# Altium project TASK1.1.PrjPcb
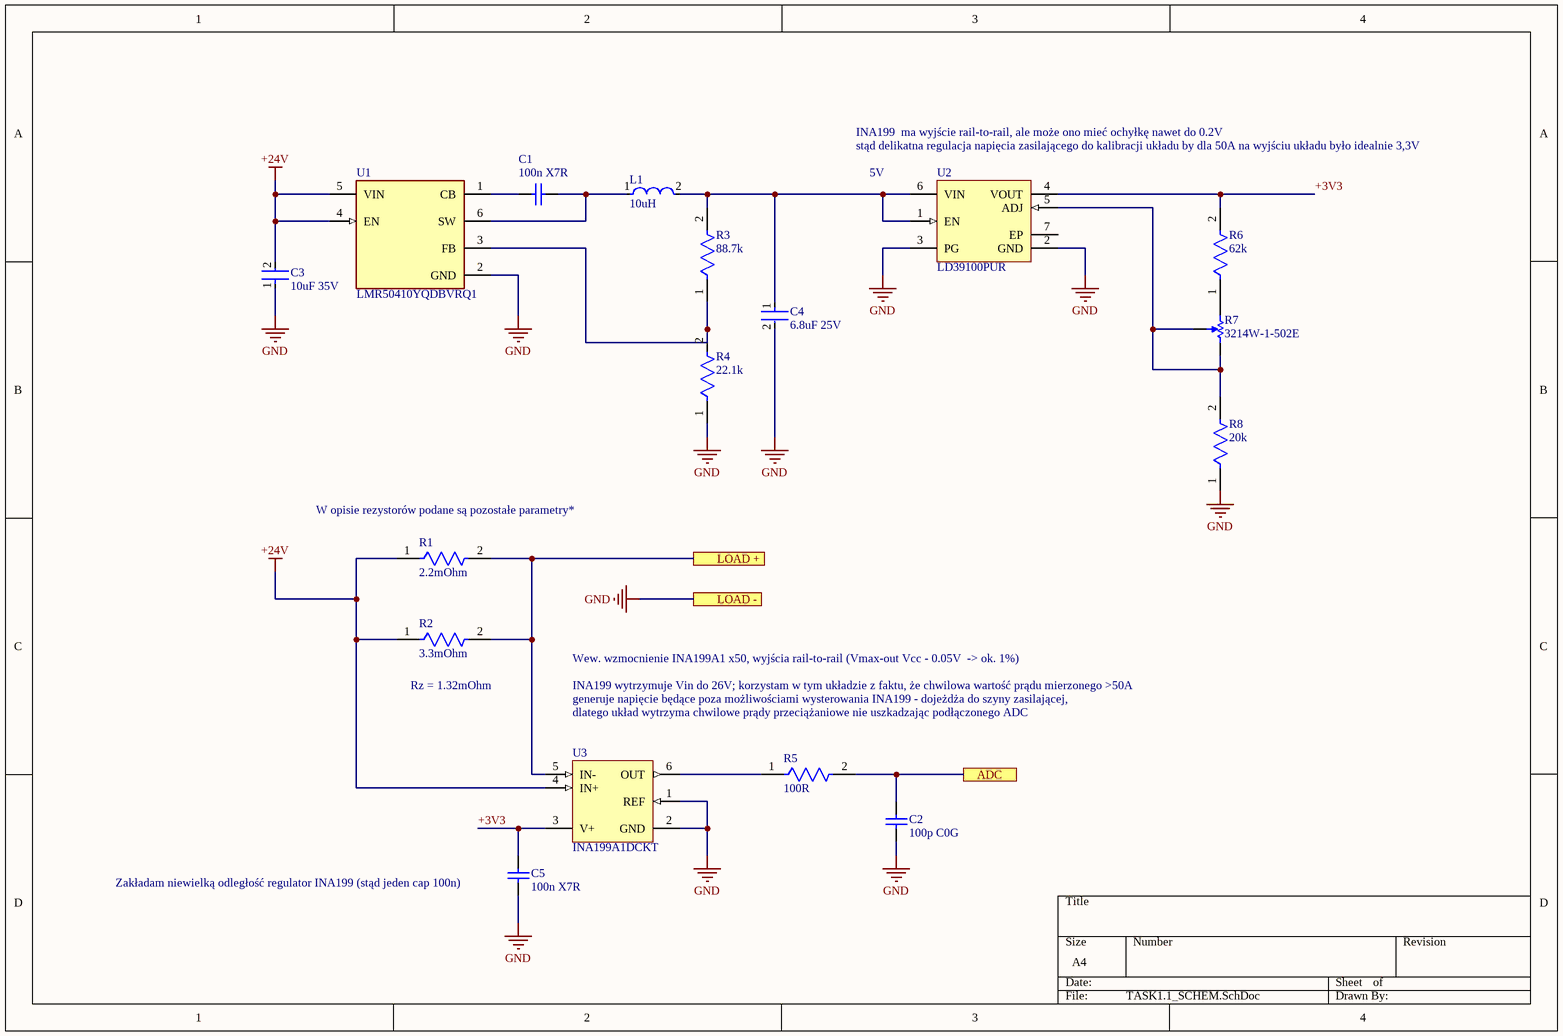
[diagram p0: TASK1.1_SCHEM.SchDoc]
1 sheet, 17 parts. Net scope: flat (ports and power ports of the same name join across sheets).
Board file: TASK1.1_PCB.PcbDoc

## Sheet TASK1.1_SCHEM.SchDoc
size A4; SheetNumber: 1; SheetTotal: 1

### Parts
C1  100n X7R  [CAPC1608X90X35LL15T15]
C2  100p C0G  [CAPC1608X95X40ML15T15]
C3  10uF 35V  [FP-C3216-160-0_2-IPC_C]
C4  6.8uF 25V  [FP-C2012-125-0_2-IPC_A]
C5  100n X7R  [CAPC1608X90X35LL15T15]
L1  10uH  [FP-NR6045-MFG]
R1  2.2mOhm  [FP-CRCW2512-e3-IPC_C]
R2  3.3mOhm  [FP-CRCW2512-e3-IPC_C]
R3  88.7k  [FP-CRCW0603-e3-MFG]
R4  22.1k  [FP-RP73P-1J-MFG]
R5  100R  [FP-ERA3A-IPC_B]
R6  62k  [FP-ERJ2RK-MFG]
R7  3214W-1-502E  [BOUR-3214W_V]
R8  20k  [FP-RC0402-0_4-MFG]
U1  LMR50410YQDBVRQ1  [FP-DBV0006A-MFG]
U2  LD39100PUR  [DFN6D_M]
U3  INA199A1DCKT  [DCK0006A_N]

### Ports
ADC, LOAD +, LOAD -

### Nets
+24V: C3.2 R1.1 R2.1 U1.4(EN) U1.5(VIN) U3.4(IN+)
GND: C2.1 C3.1 C4.2 C5.1 R4.1 R8.1 U1.2(GND) U2.2(GND) U2.3(PG) U3.1(REF) U3.2(GND) ; port LOAD -
+3V3: C5.2 R6.2 U2.4(VOUT) U3.3(V+)
NetC1_1: C1.1 U1.1(CB)
NetC1_2: C1.2 L1.1 U1.6(SW)
NetC2_2: C2.2 R5.2 ; port ADC
NetC4_1: C4.1 L1.2 R3.2 U2.1(EN) U2.6(VIN)
NetR1_2: R1.2 R2.2 U3.5(IN-) ; port LOAD +
NetR3_1: R3.1 R4.2 U1.3(FB)
NetR5_1: R5.1 U3.6(OUT)
NetR6_1: R6.1 R7.1
NetR7_2: R7.2 R7.3 R8.2 U2.5(ADJ)

Not connected (* = marked no-connect by the designer): U2 7(EP)

### Notes on the sheet
- INA199  ma wyjście rail-to-rail, ale może ono mieć ochyłkę nawet do 0.2V
- (near U2) stąd delikatna regulacja napięcia zasilającego do kalibracji układu by dla 50A na wyjściu układu było idealnie 3,3V
- 5V
- (near R1) W opisie rezystorów podane są pozostałe parametry*
- (near R2) Rz = 1.32mOhm
- Wew. wzmocnienie INA199A1 x50, wyjścia rail-to-rail (Vmax-out Vcc - 0.05V  -> ok. 1%)
- INA199 wytrzymuje Vin do 26V; korzystam w tym układzie z faktu, że chwilowa wartość prądu mierzonego >50A
- generuje napięcie będące poza możliwościami wysterowania INA199 - dojeżdża do szyny zasilającej,
- dlatego układ wytrzyma chwilowe prądy przeciążaniowe nie uszkadzając podłączonego ADC
- (near C5) Zakładam niewielką odległość regulator INA199 (stąd jeden cap 100n)

### Library data of the parts
C1 C5 = CMP-2006-02168-1: Manufacturer: AVX Interconnect / Elco; Part Number: LD035C104KAB2A
C2 = CMP-2006-01530-1: Manufacturer: Vitramon; Part Number: VJ0603A101JXACW1BC
C3 = CMP-2000-06048-2: Multilayer Ceramic Capacitors 10uF ±20% 35V X7R SMD 1206; RoHS Compliant: Yes; Voltage Rating (DC): 35V; Termination: SMD/SMT; Thickness: 0.071inch; Max Operating Temperature: 125°C; Length: 3.2mm; Width: 0.063inch; Tolerance: 20%; Case Code (Metric): 3216; Capacitance: 10uF; REACH SVHC: No SVHC; Case/Package: 1206; Dielectric: X7R; Series: C; Min Operating Temperature: -55°C; Resistor Type: Ceramic; Weight: 0.000571oz; Voltage Rating: 35V; Mount: Surface Mount; Package Quantity: 2000; Case Code (Imperial): 1206; Depth: 1.6mm; Packaging: Tape and Reel; Dielectric Material: Ceramic; Lead Free: Lead Free; Height: 1.6mm; Construction: Flat
C4 = CMP-08246-007145-1: Multilayer Ceramic Capacitors 6.8μF ±20% 25V X5R SMD 0805; Case Code (Metric): 2012; Case Code (Imperial): 0805; Dielectric: X5R; Package Quantity: 1; Min Operating Temperature: -55°C; Construction: Flat; Tolerance: 20%; Voltage Rating: 25V; Weight: 0.000194oz; Height: 1.25mm; Case/Package: 0805; Dielectric Material: Ceramic; Length: 2mm; Lead Free: Lead Free; Mount: Surface Mount; RoHS Compliant: Yes; Voltage Rating (DC): 25V; Series: C; Depth: 1.25mm; Termination: SMD/SMT; Capacitance: 6.8uF; Thickness: 0.057inch; Width: 0.049inch; Max Operating Temperature: 85°C; Packaging: Tape and Reel; Resistor Type: Ceramic
L1 = CMP-14484-001321-1: Shielded Wirewound Inductor 10uH 20% 2.8A 59.8mΩ SMD; DC Resistance (DCR): 59.8mR; Test Frequency: 100kHz; Self Resonant Frequency: 12MHz; Core Material: Ferrite; Max DC Current: 3.1A; RMS Current (Irms): 2.4A; Inductance: 10uH; Length: 6mm; Height - Seated (Max): 0.177inch; Series: NRS; Min Operating Temperature: -25°C; Tolerance: 20%; Radiation Hardening: No; Halogen Free: Halogen Free; Shielding: Shielded; Resistor Type: Wirewound; Case/Package: Nonstandard; Number of Pins: 2; Package Quantity: 1500; Width: 0.236inch; Depth: 6.2mm; Max Operating Temperature: 125°C; Packaging: Tape and Reel; Lead Free: Lead Free; Mount: Surface Mount; RoHS Compliant: Yes; Height: 4.5mm; Lead Pitch: 4.7mm; Saturation Current: 3.1A; Termination: SMD/SMT; Current Rating: 2.4A; Inductance Tolerance: 20%
R1 = CMP-02407-005447-1: WSL25122L200FEA18 / RES 0.0022 OHM 1% 2W 2512; Power Rating: 1W; Temperature Coefficient: 100ppm/°C; Voltage Rating: 500V; Resistance: 1MR; Height: 0.6mm; Number of Pins: 2; Min Operating Temperature: -55°C; Weight: 0.001429oz; Contact Plating: Tin; Max Power Dissipation: 1W; Radiation Hardening: No; REACH SVHC: No SVHC; Tolerance: 1%; Termination: SMD/SMT; Lead Free: Lead Free; Package Quantity: 10; Voltage Rating (DC): 500V; Case Code (Imperial): 2512; Packaging: Tape and Reel; Military Standard: Not; Width: 3.15mm; Case/Package: 2512; Case Code (Metric): 6432; Length: 6.3mm; Max Operating Temperature: 155°C; Number of Terminations: 2; Depth: 3.15mm; Composition: Thick Film; Features: Automotive AEC-Q200
R2 = CMP-02407-005447-1: WSL28163L300FEH / RES 0.0033 OHM 1% 2W 2816; Power Rating: 1W; Temperature Coefficient: 100ppm/°C; Voltage Rating: 500V; Resistance: 1MR; Height: 0.6mm; Number of Pins: 2; Min Operating Temperature: -55°C; Weight: 0.001429oz; Contact Plating: Tin; Max Power Dissipation: 1W; Radiation Hardening: No; REACH SVHC: No SVHC; Tolerance: 1%; Termination: SMD/SMT; Lead Free: Lead Free; Package Quantity: 10; Voltage Rating (DC): 500V; Case Code (Imperial): 2512; Packaging: Tape and Reel; Military Standard: Not; Width: 3.15mm; Case/Package: 2512; Case Code (Metric): 6432; Length: 6.3mm; Max Operating Temperature: 155°C; Number of Terminations: 2; Depth: 3.15mm; Composition: Thick Film; Features: Automotive AEC-Q200
R3 = CMP-1012-00730-3: RES Thick Film, 88.7kΩ, 1%, 0.1W, 100ppm/°C, 0603; Resistance: 88.7kR; Power Rating: 100mW; Voltage Rating: 75V; Height: 0.45mm; Weight: 7.1E-05oz; Max Operating Temperature: 155°C; Tolerance: 1%; Radiation Hardening: No; Military Standard: Not; Composition: Thick Film; Contact Plating: Tin; Packaging: Tape and Reel; Case/Package: 0603; Package Quantity: 10; Min Operating Temperature: -55°C; Termination: Solder; Width: 0.033inch; Case Code (Metric): 1608; Number of Terminations: 2; Length: 1.55mm; Features: Automotive AEC-Q200; Temperature Coefficient: 100ppm/°C; Max Power Dissipation: 100mW; Case Code (Imperial): 0603; Depth: 0.85mm
R4 = CMP-03211-005002-1: RES SMD 22.1K OHM 0.1% 1/6W 0603; Manufacturer: TE Connectivity; Manufacturer Part Number: RP73PF1J22K1BTDF; Resistance: 22.1KΩ; Value: 22.1KΩ; Tolerance: 0.001; Power Rating: 0.166W; Voltage Rating: 100V; Temperature Coefficient: 25ppm/°C; Lead Free: Yes; ComponentLink2Description: Datasheet; Temperature Range High: +155°C; Series: RP73P; Category: Res; Package: RP73P-1J; Digikey Description: RES SMD 22.1K OHM 0.1% 1/6W 0603; Device Class L2: Resistors; RoHS: TRUE; Device Class L3: Chip SMD Resistors; Temperature: -55°C to +155°C; Composition: Thin Film; ComponentLink2URL: https://www.te.com/commerce/DocumentDelivery/DDEController?Action=srchrtrv&DocNm=1773272&DocType=DS&DocLang=English; Device Class L1: Passive Components; Ipc Land Pattern Name: RESC15580X45; Automotive: No; Temperature Range Low: -55°C; Octopart: https://octopart.com/rp73pf1j22k1btdf-te+connectivity-23826867; Height: 0.55mm
R5 = CMP-2000-00870-2: RES SMD 100 OHM 0.1% 1/10W 0603; Voltage Rating: 75V; Power Rating: 100mW; Temperature Coefficient: 25ppm/°C; Number of Terminations: 2; Case/Package: 0603; Termination: SMD/SMT; Number of Pins: 2; Size Code: 0603; Length: 1.6mm; Min Operating Temperature: -55°C; Resistor Type: Thin Film; Depth: 0.8mm; Military Standard: Not; Packaging: Tape and Reel; RoHS Compliant: Yes; Construction: Rectangular; Resistance Tolerance: 0.1%; Contact Plating: Tin; Resistance: 100R; Width: 0.8mm; Mount: Surface Mount; Case Code (Metric): 1608; Max Operating Temperature: 155°C; Height: 0.45mm; Case Code (Imperial): 0603; Series: ERA-3A; Package Quantity: 5000; REACH SVHC: No SVHC; Tolerance: 0.1%; Max Power Dissipation: 100mW; Radiation Hardening: No; Technology: METAL FILM
R6 = CMP-2002-01165-2: NexarPartId: 55404988; Voltage Rating (DC): 50V; Power Rating: 100mW; Temperature Coefficient: 100ppm/°C; Resistance: 62kΩ; Tolerance: 1%; Min Operating Temperature: -55°C; RoHS: Compliant; Case/Package: 0402; Composition: Thick Film; Lead Free: Lead Free; Packaging: Cut Tape; Mount: Surface Mount; Contact Plating: Tin; Depth: 500µm; Schedule B: 8533210045, 8533210045; Max Operating Temperature: 155°C; Termination: SMD/SMT; Case Code (Imperial): 0402; Features: Automotive AEC-Q200; Max Power Dissipation: 100mW; Voltage Rating: 50V; Military Standard: Not; Number of Terminations: 2; Lifecycle Status: Production; REACH SVHC: No SVHC; Length: 1mm; Width: 508µm; Case Code (Metric): 1005; Height: 350µm
R7 = CMP-2000-05579-1: 3214 - 5-Turn Trimpot(R) Trimming Potentiometer, 5 KOhm, +/- 10%, 0.25 W, -65 to 150 degC, RoHS, Tape and Reel; Manufacturer: Bourns; Temperature Coefficient: ±100ppm/°C; Power Rating: 250mW; No. of Turns: 5; Track Resistance: 5kohm; SVHC: NoSVHC(16-Jun-2014); Potentiometer Mounting: SMD; Manufacturer URL: http://www.bourns.com/; Resistance Tolerance: ±10%; Datasheet URL: http://www.bourns.com/docs/Product-Datasheets/3214.pdf; ROHS COMPLIANT: Yes; Mounting Technology: SurfaceMount; Datasheet Version: 05/2016; Package Reference: 3214W; Package Description: 3-Pin Surface Mount Device, Body 3.5 x 4.8 mm, Pitch 1.25 mm
R8 = CMP-2002-07501-2: NexarPartId: 39794396; Resistance: 20kΩ; Max Power Dissipation: 63mW; Voltage Rating: 50V; Temperature Coefficient: 100ppm/°C; Power Rating: 62.5mW; Tolerance: 1%; Termination: SMD/SMT; Features: Moisture Resistant; Max Operating Temperature: 155°C; Number of Pins: 2; Length: 1mm; Min Operating Temperature: -55°C; RoHS: Compliant; Width: 500µm; Composition: Thick Film; Case/Package: 0402; Depth: 500µm; Lead Free: Lead Free; Height: 350µm; Packaging: Tape & Reel; Military Standard: Not; Case Code (Imperial): 0402; Case Code (Metric): 1005; Schedule B: 8533210045, 8533210045; Number of Terminations: 2; Voltage Rating (DC): 50V; REACH SVHC: No SVHC
U1 = CMP-04918-000478-1: NIXON PLUS-LMR50410YQDBVRQ1
U2 = CMP-0244-00287-1: 1 A Low Quiescent Current Low Noise Voltage Regulator, Adjustable from 0.8V, 6-Pin VFDFPN, Tape and Reel; ComponentLink1URL: http://www.st.com; ComponentLink1Description: Manufacturer URL; ComponentLink2Description: Datasheet; DatasheetVersion: 1/10/2011; PackageDescription: 6-Pin Plastic, Dual LLP, 3 x 3 mm Body, 0.95 mm Pitch, Exposed Pad; PackageReference: DFN6D; ComponentLink2URL: http://www.st.com/internet/com/TECHNICAL_RESOURCES/TECHNICAL_LITERATURE/DATASHEET/CD00233788.pdf; PackageVersion: 2008
U3 = CMP-0704-00050-2: Voltage Output, High or Low Side Measurement, Bi-Directional Zero-Drift Series, 2.7 to 26 V, -40 to 125 degC, 6-pin SOT23 (DCK6), Green (RoHS & no Sb/Br); SubFamily: Current Shunt Monitor; Vs(Max)(V): 26; Rating: Catalog; CMRR(Min)(dB): 100; Small-Signal Bandwidth(Typ)(MHz): 0.03; Input Offset Drift (+/-)(Max)(uV/Degrees Celsius): 0.5; Common Mode Range(Min)(V): -0.3; Gain(V/V): 50; Quiescent Current (+/-)(Typ)(mA): 0.065; Vs(Min)(V): 2.7; Input Offset (+/-)(Max)(uV): 150; PartNumber: INA199A1DCKT; ComponentLink3URL: http://www.ti.com/lit/ds/symlink/ina212-q1.pdf; Mounting Technology: Surface Mount; DatasheetVersion: SBOS469D; Output Type: Voltage; PackageDescription: 6-Pin Plastic Small Outline, Body 2 x 1.25 mm, Pitch 0.65 mm; Eco-Plan: Green (RoHS & no Sb/Br); ComponentLink2URL: http://www.ti.com/general/docs/lit/getliterature.tsp?genericPartNumber=INA199A1&fileType=pdf; ComponentLink1Description: Manufacturer URL; PackageVersion: 4093553-4/G, 01/2007; ComponentLink1URL: http://www.ti.com/; Code_JEDEC: MO-203; ComponentLink2Description: Datasheet; ComponentLink3Description: Package Specification; Common Mode Range(Max)(V): 26; PackageReference: DCK0006A